# EAGLE design arduinocade (EAGLE 6.5.0)
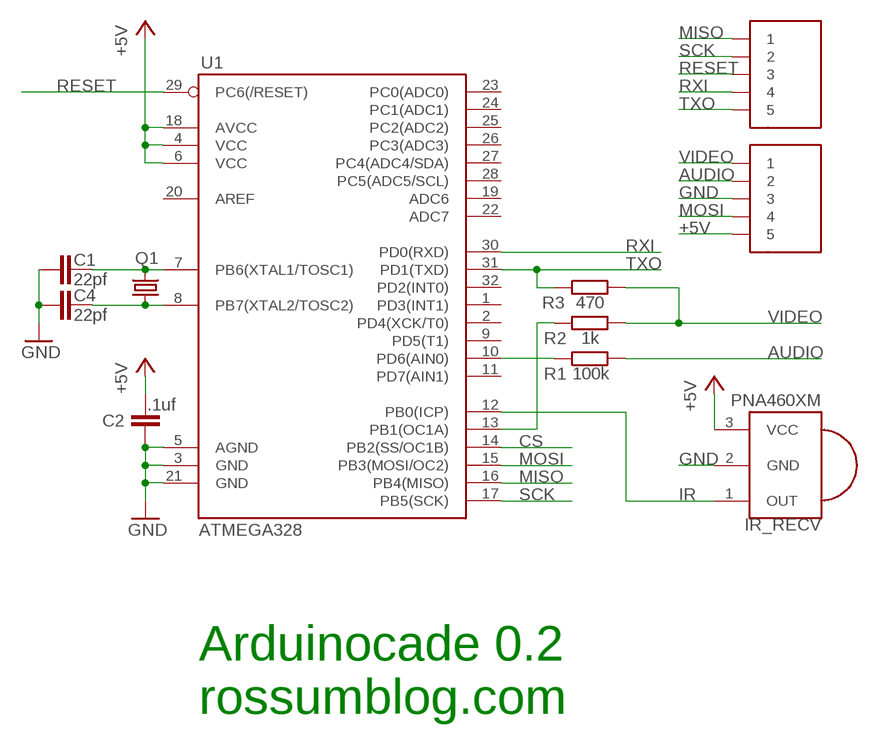
[diagram p0: schematic, sheet 1]

## Parts
C1  22pf  C-EUC0603  [C0603]
C2  .1uf  C-EUC0603  [C0603]
C4  22pf  C-EUC0603  [C0603]
IR_RECV  PNA460XM  [PNA460XM]
Q1  CRYSTALCTS406  [CTS406]
R1  100k  R-EU_R0603  [R0603]
R2  1k  R-EU_R0603  [R0603]
R3  470  R-EU_R0603  [R0603]
U1  ATMEGA328  ATMEGA168  [TQFP32-08]
U$2  EDGE5  [EDGE5]
U$3  EDGE5  [EDGE5]

## Nets
+5V [vcc]: C2.1 U1.4(VCC) U1.6(VCC) U1.18(AVCC) U$3.5
AUDIO: R1.2 U$3.2
CS: U1.14(PB2(SS/OC1B))
GND [vcc]: C1.2 C2.2 C4.2 IR_RECV.2(GND) U1.3(GND) U1.5(AGND) U1.21(GND) U$3.3
IR: IR_RECV.1(OUT) U1.12(PB0(ICP))
MISO: U1.16(PB4(MISO)) U$2.1
MOSI: U1.15(PB3(MOSI/OC2)) U$3.4
N$1: C4.1 Q1.1 U1.8(PB7(XTAL2/TOSC2))
N$2: C1.1 Q1.3 U1.7(PB6(XTAL1/TOSC1))
N$7: R2.1 U1.13(PB1(OC1A))
N$8: R1.1 U1.10(PD6(AIN0))
RESET: U1.29(PC6(/RESET)) U$2.3
RXI: U1.30(PD0(RXD)) U$2.4
SCK: U1.17(PB5(SCK)) U$2.2
TXO: R3.1 U1.31(PD1(TXD)) U$2.5
VCC: IR_RECV.3(VCC) ; supply symbol labelled +5V
VIDEO: R2.2 R3.2 U$3.1
Unconnected: U1.1(PD3(INT1)) U1.2(PD4(XCK/T0)) U1.9(PD5(T1)) U1.11(PD7(AIN1)) U1.19(ADC6) U1.20(AREF) U1.22(ADC7) U1.23(PC0(ADC0)) U1.24(PC1(ADC1)) U1.25(PC2(ADC2)) U1.26(PC3(ADC3)) U1.27(PC4(ADC4/SDA)) U1.28(PC5(ADC5/SCL)) U1.32(PD2(INT0))

## Notes on the sheet
- Arduinocade 0.2
- rossumblog.com

## Library data of the parts
C1 C2 C4 = rcl:C-EU: CAPACITOR, European symbol
IR_RECV = adafruit:PNA460XM: IR 38KHz receiver PNA4602 and related receivers http://www.ladyada.net/library/pcb/eaglelibrary.html
Q1 = adafruit:CRYSTAL: CRYSTAL; OC_FARNELL: unknown; OC_NEWARK: unknown
R1-R3 = rcl:R-EU_: RESISTOR, European symbol
U1 = SparkFun:ATMEGA168
U$2 U$3 = edges:EDGE5

## Net classes
1 vcc: width 0.254 mm

## Board
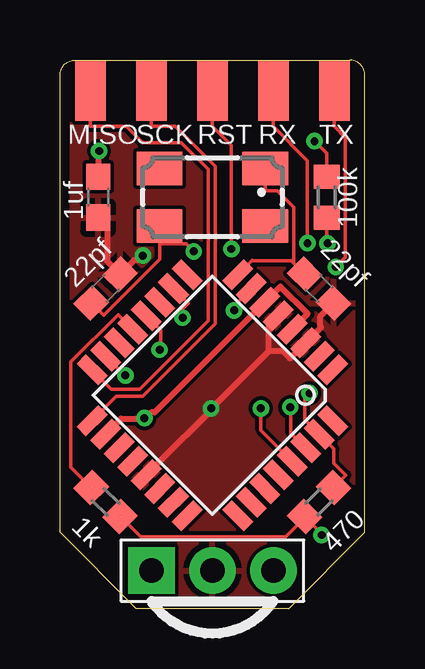
[diagram p1: board, top side]
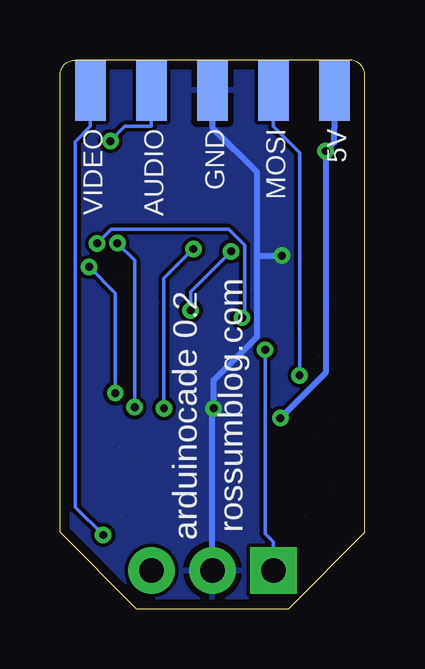
[diagram p2: board, bottom side, seen from below]

Size 12.7 x 22.86 mm. Coordinates in mm from the lower left corner, seen from the top.
Outline: 12.7,3.17 12.7,22.23 arc90 12.06,22.86 0.64,22.86 arc90 0,22.23 0,3.17 3.17,0 9.53,0 12.7,3.17
Copper layers (1*16): Top 0.0356mm / dielectric 1.5011mm / Bottom 0.0356mm
Design rules "LaenPCBOrder *": minimum track width 6mil, minimum drill 13mil, track to track 6mil, track to pad 6mil, pad to pad 6mil, via to via 6mil, smd to smd 6mil, copper to edge 15mil, drill to drill 6mil, minimum pad ring 7mil, minimum via ring 7mil, stop-mask expansion 3mil, vias tented up to drill 20mil, thermal gap 10mil

### Footprints (pad centres in the part's own frame; a part is rotated, then mirrored left to right if it is on the bottom)
C0603 = smd 1.1 x 1: 1 -0.85,0; 2 0.85,0
PNA460XM = drill 1.016 pad 1.93 square: 1 -2.54,0 | drill 1.016 pad 1.93: 2 0,0; 3 2.54,0
CTS406 = smd 1.9 x 1.4: 1 -2.2,-1.2; 2 2.2,-1.2; 3 2.2,1.2; 4 -2.2,1.2
R0603 = smd 1 x 1.1: 1 -0.85,0; 2 0.85,0
TQFP32-08 = smd 1.27 x 0.559: 1 -4.293,2.8; 2 -4.293,2; 3 -4.293,1.2; 4 -4.293,0.4; 5 -4.293,-0.4; 6 -4.293,-1.2; 7 -4.293,-2; 8 -4.293,-2.8; 17 4.293,-2.8; 18 4.293,-2; 19 4.293,-1.2; 20 4.293,-0.4; 21 4.293,0.4; 22 4.293,1.2; 23 4.293,2; 24 4.293,2.8 | smd 0.559 x 1.27: 9 -2.8,-4.293; 10 -2,-4.293; 11 -1.2,-4.293; 12 -0.4,-4.293; 13 0.4,-4.293; 14 1.2,-4.293; 15 2,-4.293; 16 2.8,-4.293; 25 2.8,4.293; 26 2,4.293; 27 1.2,4.293; 28 0.4,4.293; 29 -0.4,4.293; 30 -1.2,4.293; 31 -2,4.293; 32 -2.8,4.293
EDGE5 = smd 1.27 x 2.54: 1 -5.08,0; 2 -2.54,0; 3 0,0; 4 2.54,0; 5 5.08,0

### Placement (x,y rotation side)
C1  1.91,13.34 45 top
C2  1.59,17.14 270 top
C4  10.79,13.34 315 top
IR_RECV  6.35,1.59 0 top
Q1  6.35,17.14 180 top
R1  11.11,17.14 90 top
R2  1.91,4.45 315 top
R3  10.79,4.45 225 top
U1  6.35,8.89 225 top
U$2  6.35,21.59 0 top
U$3  6.35,21.59 0 bottom

### Tracks (layer width: path | path; a pad name or v marks a point on that pad's centre or on a via)
+5V  (via drill 0.33 pad 0.69)  (3 unrouted)
  Top 0.254: 2.55,7.92 | 2.55,7.92 3.22,7.92 3.24,7.93 v3.52,7.93 3.56,7.93 3.8,8.18 3.94,8.18 7.89,12.13 U1.6 9.18,13.42 10.31,12.29 U1.4 | U1.18 2.55,7.92 | v1.63,19.07 1.59,19.03 C2.1
  Bottom 0.254: v3.52,7.93 1.63,9.82 v1.63,19.07 1.27,19.43 1.27,20.04 U$3.5
AUDIO  (via drill 0.33 pad 0.69)  (1 unrouted)
  Top 0.152: v10.6,19.48 11.11,18.97 11.11,18.72 R1.2
  Bottom 0.152: v10.6,19.48 9.99,20.09 8.89,20.09 U$3.2
GND  (via drill 0.33 pad 0.69)
  Top 0.254: 8.7,10.72 6.33,8.35 v6.29,8.35 6.29,8.28 6.17,8.16 6.17,8.14 4.24,6.22 U1.21 | 8.7,10.72 8.7,11.81 U1.5 | 8.7,10.72 9.3,10.72 9.59,10.43 U1.3 10.88,11.72 10.85,11.76 10.85,12.18 11.12,12.46 C4.2 | v3.45,14.71 3.27,14.52 3.09,14.52 C1.2 1.96,14.49 1.98,14.51 1.98,16.3 C2.2
  Bottom 0.254: 4.48,14.71 4.48,11.34 6.29,9.52 v6.29,8.35 6.35,8.29 IR_RECV.2 | 4.48,14.71 4.48,18.17 6.35,20.04 U$3.3 | 4.48,14.71 v3.45,14.71
  pour Bottom: 0,0 0,22.86 12.7,22.86 12.7,0
  pour Top: 0,0 0,22.86 12.7,22.86 12.7,0
IR  (via drill 0.33 pad 0.69)  (1 unrouted)
  Top 0.152: v4.15,10.79 4.21,10.85 4.21,11.6 U1.12
  Bottom 0.152: v4.15,10.79 4.15,3.12 3.81,2.78 IR_RECV.1
MISO  (1 unrouted)
  Top 0.152: U1.16 2.13,9.15 3.33,9.15 6.17,11.99 6.17,18.3 5.05,19.42 3.44,19.42 2.77,20.09 1.27,20.09 U$2.1
MOSI  (via drill 0.33 pad 0.69)  (1 unrouted)
  Top 0.152: U1.15 2.69,9.72 v2.72,9.72
  Bottom 0.152: v2.72,9.72 2.72,19 3.81,20.09 U$3.4
N$1  (2 unrouted)
  Top 0.152: 9.74,14.39 9.78,14.35 C4.1 | 9.74,14.39 9.74,16.73 9.06,17.42 8.55,17.42 Q1.1 | 9.74,14.39 9.64,14.49 | U1.8 8.02,14.52 8.04,14.49 9.64,14.49 | 9.64,14.49
N$2  (via drill 0.33 pad 0.69)  (2 unrouted)
  Top 0.152: 4.15,15.2 5.26,15.2 v5.57,14.89 | U1.7 7.36,12.73 7.36,12.53 v7.25,12.43 | 4.15,15.2 4.15,15.02 4.15,14.55 1.82,12.22 C1.1 | Q1.3 4.15,15.2
  Bottom 0.152: v7.25,12.43 | v7.25,12.43 7.25,13.21 v5.57,14.89
N$7  (2 unrouted)
  Top 0.152: U1.13 2.42,12.25 0.46,10.29 0.46,5.89 R2.1
N$8  (via drill 0.33 pad 0.69)  (2 unrouted)
  Top 0.152: v11.15,15.22 11.15,15.53 11.11,15.57 R1.1 | U1.10 5.34,12.73 5.11,12.5 v5.11,12.12
  Bottom 0.152: v5.11,12.12 5,12.23 5,15.13 5.67,15.8 10.56,15.8 v11.15,15.22
RESET  (via drill 0.33 pad 0.69)  (1 unrouted)
  Top 0.152: v8.37,8.35 8.37,7.44 9.06,6.75 U1.29 | v7.14,14.99 7.14,19.3 6.35,20.09 U$2.3
  Bottom 0.152: v7.14,14.99 8.37,13.76 v8.37,8.35
RXI  (via drill 0.33 pad 0.69)  (1 unrouted)
  Top 0.152: v9.59,8.39 9.62,8.37 9.62,7.31 U1.30 | v10.31,15.23 10.31,18.67 8.89,20.09 U$2.4
  Bottom 0.152: v10.31,15.23 9.59,14.51 v9.59,8.39
SCK  (1 unrouted)
  Top 0.152: U1.17 2.35,8.85 3.46,8.85 6.47,11.86 6.47,18.43 4.81,20.09 3.81,20.09 U$2.2
TXO  (via drill 0.33 pad 0.69)  (2 unrouted)
  Top 0.152: v10.4,8.98 10.19,8.77 10.19,7.88 U1.31 11.41,6.66 | v11.49,14.24 11.89,14.64 11.89,19.63 11.43,20.09 U$2.5 | R3.1 11.91,5.56 11.41,6.06 11.41,6.66 | 11.41,6.66
  Bottom 0.152: v11.49,14.24 10.4,13.15 v10.4,8.98
VIDEO  (via drill 0.33 pad 0.69)  (2 unrouted)
  Top 0.152: v10.9,3.07 10.9,3.14 10.74,3.29 10.23,3.81 | 10.23,3.81 9.41,3 3.35,3 R2.2 | R3.2 10.23,3.81
  Bottom 0.152: v10.9,3.07 12.06,4.23 12.06,19.46 11.43,20.09 U$3.1

### Text on the board
tPlace: MISO | SCK | RST | RX | TX | 1uf | 22pf | 22pf
bPlace: 5V | MOSI | GND | AUDIO | VIDEO | rossumblog.com | arduinocade 0.2